# EAGLE design iomodul (EAGLE 6.2)

## Sheet 1 of 4
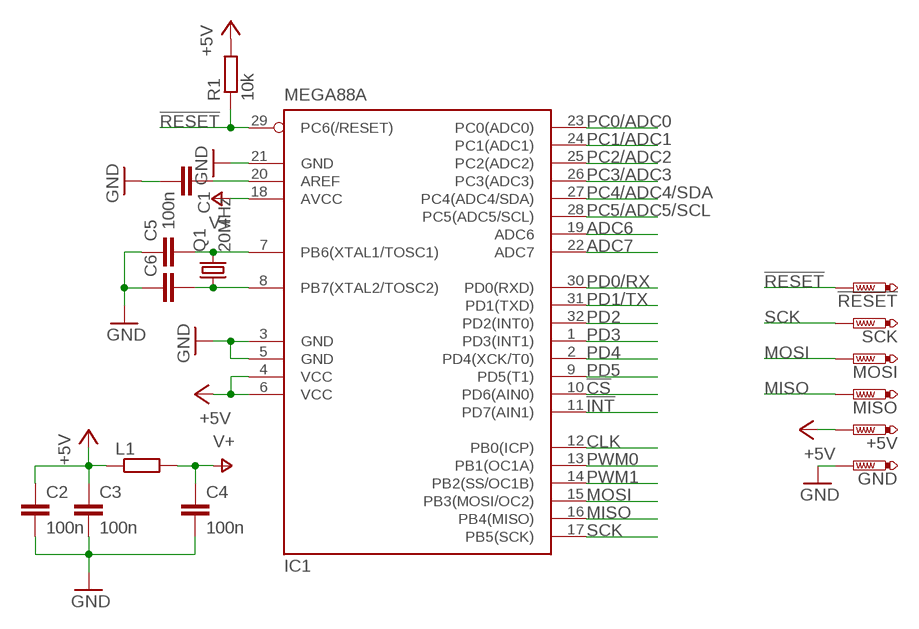
[diagram p0: schematic, sheet 1]

### Parts
!RESET  PTR1TP12R  [TP12R]
+5V  PTR1TP12R  [TP12R]
C1  100n  C-EUC0805  [C0805]
C2  100n  C-EUC0805  [C0805]
C3  100n  C-EUC0805  [C0805]
C4  100n  C-EUC0805  [C0805]
C5  C-EUC0805  [C0805]
C6  C-EUC0805  [C0805]
GND  PTR1TP12R  [TP12R]
IC1  MEGA88A  MEGA8-AI  [TQFP32-08]
L1  R-EU_R0805  [R0805]
MISO  PTR1TP12R  [TP12R]
MOSI  PTR1TP12R  [TP12R]
Q1  20MHz  CRYSTALHC49S  [HC49/S]
R1  10k  R-EU_R0805  [R0805]
SCK  PTR1TP12R  [TP12R]

### Nets
!CS: IC1.10(PD6(AIN0)) ; also sheet 2
!INT: IC1.11(PD7(AIN1)) ; also sheet 2
!RESET: !RESET.TP IC1.29(PC6(/RESET)) R1.1 ; also sheet 2
+5V: +5V.TP C2.1 C3.1 IC1.4(VCC) IC1.6(VCC) L1.1 R1.2 ; also sheet 2,3,4
ADC6: IC1.19(ADC6) ; also sheet 4
ADC7: IC1.22(ADC7) ; also sheet 4
AREF: C1.1 IC1.20(AREF)
CLK: IC1.12(PB0(ICP)) ; also sheet 2
GND: C1.2 C2.2 C3.2 C4.2 C5.1 C6.1 GND.TP IC1.3(GND) IC1.5(GND) IC1.21(GND) ; also sheet 2,3,4
MISO: IC1.16(PB4(MISO)) MISO.TP ; also sheet 2
MOSI: IC1.15(PB3(MOSI/OC2)) MOSI.TP ; also sheet 2
PC0/ADC0: IC1.23(PC0(ADC0)) ; also sheet 3
PC1/ADC1: IC1.24(PC1(ADC1)) ; also sheet 3
PC2/ADC2: IC1.25(PC2(ADC2)) ; also sheet 3
PC3/ADC3: IC1.26(PC3(ADC3)) ; also sheet 3
PC4/ADC4/SDA: IC1.27(PC4(ADC4/SDA)) ; also sheet 3
PC5/ADC5/SCL: IC1.28(PC5(ADC5/SCL)) ; also sheet 3
PD0/RX: IC1.30(PD0(RXD)) ; also sheet 3
PD1/TX: IC1.31(PD1(TXD)) ; also sheet 3
PD2: IC1.32(PD2(INT0)) ; also sheet 3
PD3: IC1.1(PD3(INT1)) ; also sheet 3
PD4: IC1.2(PD4(XCK/T0)) ; also sheet 3
PD5: IC1.9(PD5(T1)) ; also sheet 3
PWM0: IC1.13(PB1(OC1A)) ; also sheet 3
PWM1: IC1.14(PB2(SS/OC1B)) ; also sheet 3
SCK: IC1.17(PB5(SCK)) SCK.TP ; also sheet 2
V+: C4.1 IC1.18(AVCC) L1.2
XTAL1: C5.2 IC1.7(PB6(XTAL1/TOSC1)) Q1.2
XTAL2: C6.2 IC1.8(PB7(XTAL2/TOSC2)) Q1.1

## Sheet 2 of 4
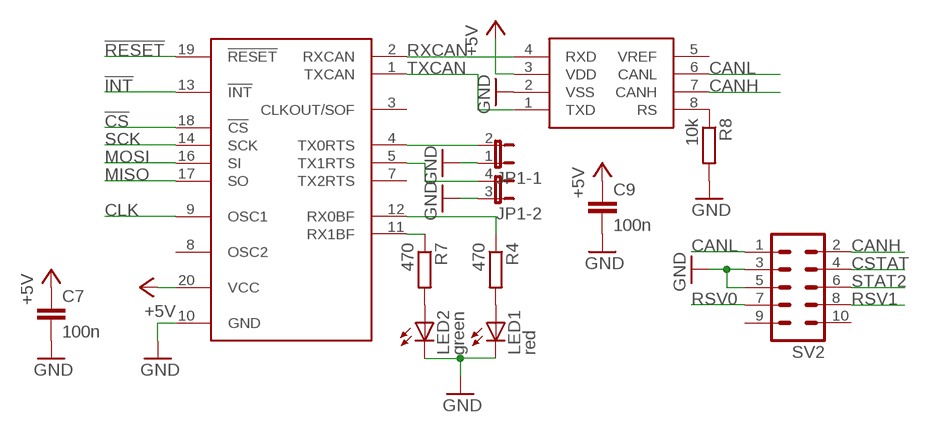
[diagram p1: schematic, sheet 2]

### Parts
C7  100n  C-EUC0805  [C0805]
C9  100n  C-EUC0805  [C0805]
JP1  JP2QE  [JP2Q]
LED1  red  LEDCHIP-LED0805  [CHIP-LED0805]
LED2  green  LEDCHIP-LED0805  [CHIP-LED0805]
R4  470  R-EU_R0805  [R0805]
R7  470  R-EU_R0805  [R0805]
R8  10k  R-EU_R0805  [R0805]
SV2  MA05-2  [MA05-2]
U$1  MCP2515  [TSSOP20]
U$2  MCP2551  [SO-08]

### Nets
!CS: U$1.18(!CS) ; also sheet 1
!INT: U$1.13(!INT) ; also sheet 1
!RESET: U$1.19(!RESET) ; also sheet 1
+5V: C7.1 C9.1 U$1.20(VCC) U$2.3(VDD) ; also sheet 1,3,4
CANH: SV2.2 U$2.7(CANH)
CANL: SV2.1 U$2.6(CANL)
CLK: U$1.9(OSC1) ; also sheet 1
CSTAT: SV2.4
GND: C7.2 C9.2 JP1.1 JP1.3 LED1.C LED2.C R8.2 SV2.3 SV2.5 U$1.10(GND) U$2.2(VSS) ; also sheet 1,3,4
LED0: LED1.A R4.2
LED1: LED2.A R7.2
LED_OUT0: R4.1 U$1.12(RX0BF)
LED_OUT1: R7.1 U$1.11(RX1BF)
MISO: U$1.17(SO) ; also sheet 1
MOSI: U$1.16(SI) ; also sheet 1
N$1: JP1.2 U$1.4(TX0RTS)
N$2: JP1.4 U$1.5(TX1RTS)
RS: R8.1 U$2.8(RS)
RSV0: SV2.7
RSV1: SV2.8
RXCAN: U$1.2(RXCAN) U$2.4(RXD)
SCK: U$1.14(SCK) ; also sheet 1
STAT2: SV2.6
TXCAN: U$1.1(TXCAN) U$2.1(TXD)
Unconnected: SV2.9 SV2.10 U$1.3(CLKOUT/SOF) U$1.7(TX2RTS) U$1.8(OSC2) U$2.5(VREF)

## Sheet 3 of 4
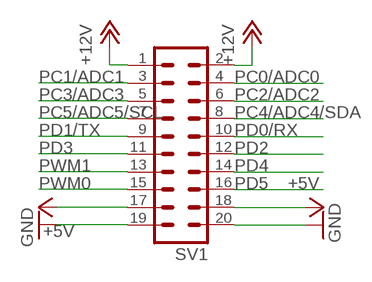
[diagram p2: schematic, sheet 3]

### Parts
SV1  MA10-2  [MA10-2]

### Nets
+5V: SV1.17 SV1.18 ; also sheet 1,2,4
+12V: SV1.1 SV1.2 ; also sheet 4
GND: SV1.19 SV1.20 ; also sheet 1,2,4
PC0/ADC0: SV1.4 ; also sheet 1
PC1/ADC1: SV1.3 ; also sheet 1
PC2/ADC2: SV1.6 ; also sheet 1
PC3/ADC3: SV1.5 ; also sheet 1
PC4/ADC4/SDA: SV1.8 ; also sheet 1
PC5/ADC5/SCL: SV1.7 ; also sheet 1
PD0/RX: SV1.10 ; also sheet 1
PD1/TX: SV1.9 ; also sheet 1
PD2: SV1.12 ; also sheet 1
PD3: SV1.11 ; also sheet 1
PD4: SV1.14 ; also sheet 1
PD5: SV1.16 ; also sheet 1
PWM0: SV1.15 ; also sheet 1
PWM1: SV1.13 ; also sheet 1

## Sheet 4 of 4
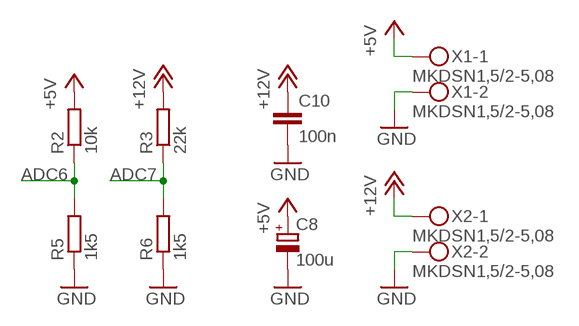
[diagram p3: schematic, sheet 4]

### Parts
C8  100u  CPOL-EUE2.5-6  [E2,5-6]
C10  100n  C-EUC0805  [C0805]
R2  10k  R-EU_R0805  [R0805]
R3  22k  R-EU_R0805  [R0805]
R5  1k5  R-EU_R0805  [R0805]
R6  1k5  R-EU_R0805  [R0805]
X1  MKDSN1,5/2-5,08  [MKDSN1,5/2-5,08]
X2  MKDSN1,5/2-5,08  [MKDSN1,5/2-5,08]

### Nets
+5V: C8.+ R2.2 X1.1 ; also sheet 1,2,3
+12V: C10.1 R3.2 X2.1 ; also sheet 3
ADC6: R2.1 R5.2 ; also sheet 1
ADC7: R3.1 R6.2 ; also sheet 1
GND: C8.- C10.2 R5.1 R6.1 X1.2 X2.2 ; also sheet 1,2,3

## Library data of the parts
!RESET +5V GND MISO MOSI SCK = testpad:PTR1: TEST PIN
C1-C7 C9 C10 = rcl:C-EU: CAPACITOR, European symbol
C8 = rcl:CPOL-EU: POLARIZED CAPACITOR, European symbol
IC1 = atmel:MEGA8: MICROCONTROLLER 8 Kbytes FLASH, 1 kbytes SRAM, 512 bytes EEPROM, USART, 6-channel 10 bit ADC, 2-channel 8 bit ADC Pin compatible with Atmega48, ATMega88, ATMega168 Source: avr.lbr; MPN: ATMEGA8-16AU; OC_FARNELL: 9171371; OC_NEWARK: 73M8863
JP1 = jumper:JP2QE: JUMPER
L1 R1-R8 = rcl:R-EU_: RESISTOR, European symbol
LED1 LED2 = led:LED: LED OSRAM: - CHIPLED LG R971, LG N971, LY N971, LG Q971, LY Q971, LO R971, LY R971 LH N974, LH R974 LS Q976, LO Q976, LY Q976 LO Q996 - Hyper CHIPLED LW Q18S LB Q993, LB Q99A, LB R99A - SideLED LS A670, LO A670, LY A670, LG A670, LP A670 LB A673, LV A673, LT A673, LW A673 LH A674 LY A675 LS A676, LA A676, LO A676, LY A676, LW A676 LS A679, LY A679, LG A679 - Hyper Micro SIDELED® LS Y876, LA Y876, LO Y876, LY Y876 LT Y87S - SmartLED LW L88C, LW L88S LB L89C, LB L89S, LG L890 LS L89K, LO L89K, LY L89K LS L896, LA L896, LO L896, LY L896 - TOPLED LS T670, LO T670, LY T670, LG T670, LP T670 LSG T670, LSP T670, LSY T670, LOP T670, LYG T670 LG T671, LOG T671, LSG T671 LB T673, LV T673, LT T673, LW T673 LH T674 LS T676, LA T676, LO T676, LY T676, LB T676, LH T676, LSB T676, LW T676 LB T67C, LV T67C, LT T67C, LS T67K, LO T67K, LY T67K, LW E67C LS E67B, LA E67B, LO E67B, LY E67B, LB E67C, LV E67C, LT E67C LW T67C LS T679, LY T679, LG T679 LS T770, LO T770, LY T770, LG T770, LP T770 LB T773, LV T773, LT T773, LW T773 LH T774 LS E675, LA E675, LY E675, LS T675 LS T776, LA T776, LO T776, LY T776, LB T776 LHGB T686 LT T68C, LB T68C - Hyper Mini TOPLED® LB M676 - Mini TOPLED Santana® LG M470 LS M47K, LO M47K, LY M47K Source: http://www.osram.convergy.de LUXEON: - LUMILED® LXK2-PW12-R00, LXK2-PW12-S00, LXK2-PW14-U00, LXK2-PW14-V00 LXK2-PM12-R00, LXK2-PM12-S00, LXK2-PM14-U00 LXK2-PE12-Q00, LXK2-PE12-R00, LXK2-PE12-S00, LXK2-PE14-T00, LXK2-PE14-U00 LXK2-PB12-K00, LXK2-PB12-L00, LXK2-PB12-M00, LXK2-PB14-N00, LXK2-PB14-P00, LXK2-PB14-Q00 LXK2-PR12-L00, LXK2-PR12-M00, LXK2-PR14-Q00, LXK2-PR14-R00 LXK2-PD12-Q00, LXK2-PD12-R00, LXK2-PD12-S00 LXK2-PH12-R00, LXK2-PH12-S00 LXK2-PL12-P00, LXK2-PL12-Q00, LXK2-PL12-R00 Source: www.luxeon.com KINGBRIGHT: KA-3528ASYC Source: www.kingbright.com
Q1 = crystal:CRYSTAL: CRYSTAL; OC_FARNELL: 1667008; OC_NEWARK: unknown
SV1 = con-lstb:MA10-2: PIN HEADER; OC_FARNELL: unknown; OC_NEWARK: unknown
SV2 = con-lstb:MA05-2: PIN HEADER; OC_FARNELL: unknown; OC_NEWARK: unknown
U$1 = mcp2515:MCP2515
U$2 = mcp2551:MCP2551
X1 X2 = con-phoenix-508:MKDSN1,5/2-5,08: MKDSN 1,5/ 2-5,08 Printklemme Nennstrom: 13,5 A Nennspannung: 250 V Rastermaß: 5,08 mm Polzahl: 2 Anschlussart: Schraubanschluss Montage: Löten Anschlussrichtung Leiter/Platine: 0 ° Artikelnummer: 1729128 Source: http://eshop.phoenixcontact.com .. 1729128.pdf; MPN: MKDSN 1,5/2-5.08; OC_FARNELL: 1792903; OC_NEWARK: 30M2397

## Board
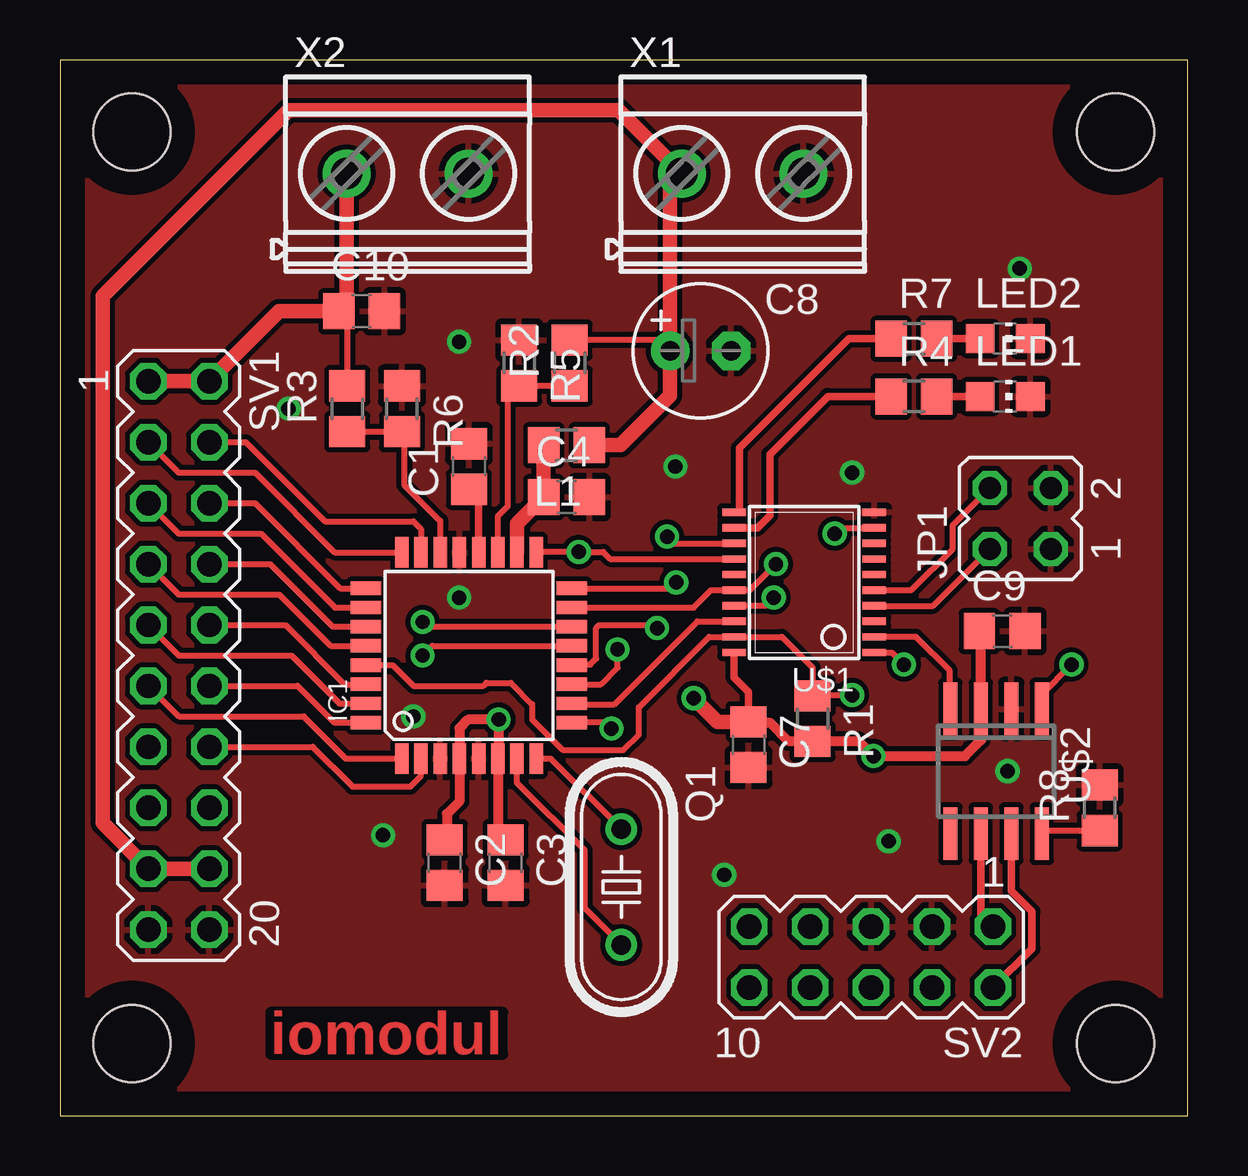
[diagram p4: board, top side]
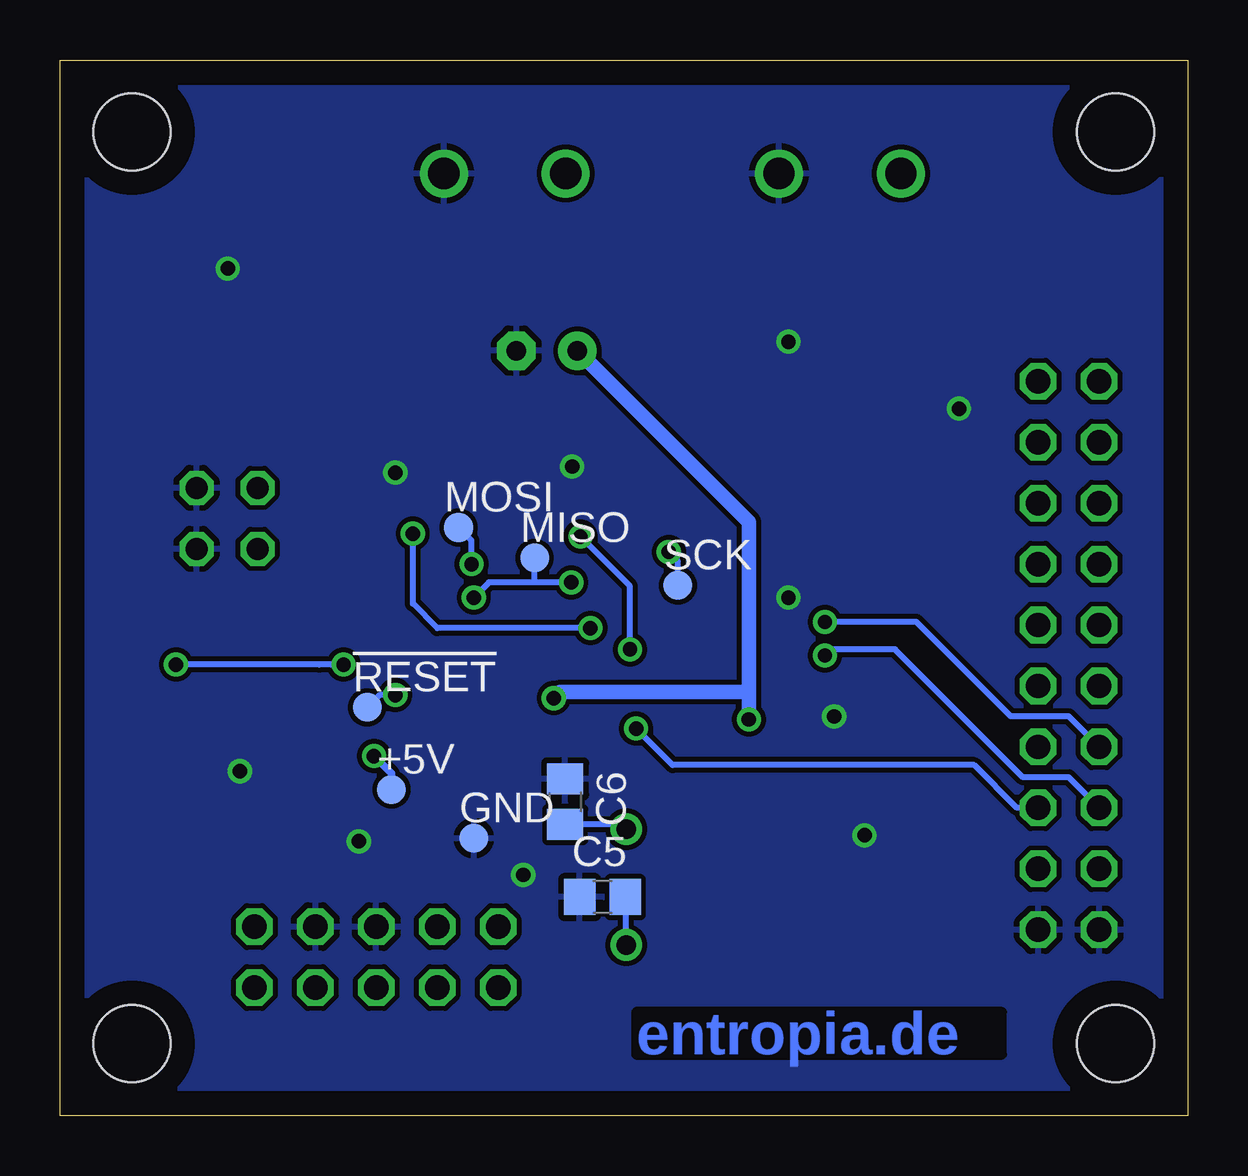
[diagram p5: board, bottom side, seen from below]

Size 47 x 44 mm. Coordinates in mm from the lower left corner, seen from the top.
Outline: 0,0 47,0 47,44 0,44 0,0
Copper layers (1*16): Top 0.035mm / dielectric 1.5mm / Bottom 0.035mm
Design rules: minimum track width 10mil, minimum drill 20mil, track to track 8mil, track to pad 8mil, pad to pad 8mil, via to via 8mil, smd to smd 8mil, copper to edge 40mil, drill to drill 8mil, minimum pad ring 10mil, minimum via ring 8mil, stop-mask expansion 4mil, vias tented up to drill 0mil, thermal gap 10mil
Holes 3.2 mm at 3,3 3,41 44,41 44,3

### Footprints (pad centres in the part's own frame; a part is rotated, then mirrored left to right if it is on the bottom)
TP12R = smd 1.2 x 1.2: TP 0,0
C0805 = smd 1.3 x 1.5: 1 -0.95,0; 2 0.95,0
E2,5-6 = drill 0.813 pad 1.6: + -1.27,0 | drill 0.813 pad 1.6 octagon: - 1.27,0
TQFP32-08 = smd 1.27 x 0.559: 1 -4.293,2.8; 2 -4.293,2; 3 -4.293,1.2; 4 -4.293,0.4; 5 -4.293,-0.4; 6 -4.293,-1.2; 7 -4.293,-2; 8 -4.293,-2.8; 17 4.293,-2.8; 18 4.293,-2; 19 4.293,-1.2; 20 4.293,-0.4; 21 4.293,0.4; 22 4.293,1.2; 23 4.293,2; 24 4.293,2.8 | smd 0.559 x 1.27: 9 -2.8,-4.293; 10 -2,-4.293; 11 -1.2,-4.293; 12 -0.4,-4.293; 13 0.4,-4.293; 14 1.2,-4.293; 15 2,-4.293; 16 2.8,-4.293; 25 2.8,4.293; 26 2,4.293; 27 1.2,4.293; 28 0.4,4.293; 29 -0.4,4.293; 30 -1.2,4.293; 31 -2,4.293; 32 -2.8,4.293
JP2Q = drill 0.914 octagon: 1 -1.27,-1.27; 2 -1.27,1.27; 3 1.27,-1.27; 4 1.27,1.27
R0805 = smd 1.3 x 1.5: 1 -0.95,0; 2 0.95,0
CHIP-LED0805 = smd 1.2 x 1.2: A 0,-1.05; C 0,1.05
HC49/S = drill 0.813: 1 -2.413,0; 2 2.413,0
MA10-2 = drill 1.016 octagon: 1 -11.43,-1.27; 2 -11.43,1.27; 3 -8.89,-1.27; 4 -8.89,1.27; 5 -6.35,-1.27; 6 -6.35,1.27; 7 -3.81,-1.27; 8 -3.81,1.27; 9 -1.27,-1.27; 10 -1.27,1.27; 11 1.27,-1.27; 12 1.27,1.27; 13 3.81,-1.27; 14 3.81,1.27; 15 6.35,-1.27; 16 6.35,1.27; 17 8.89,-1.27; 18 8.89,1.27; 19 11.43,-1.27; 20 11.43,1.27
MA05-2 = drill 1.016 octagon: 1 -5.08,-1.27; 2 -5.08,1.27; 3 -2.54,-1.27; 4 -2.54,1.27; 5 0,-1.27; 6 0,1.27; 7 2.54,-1.27; 8 2.54,1.27; 9 5.08,-1.27; 10 5.08,1.27
TSSOP20 = smd 0.305 x 0.991: 1 -2.925,-2.918; 2 -2.275,-2.918; 3 -1.625,-2.918; 4 -0.975,-2.918; 5 -0.325,-2.918; 6 0.325,-2.918; 7 0.975,-2.918; 8 1.625,-2.918; 9 2.275,-2.918; 10 2.925,-2.918; 11 2.925,2.918; 12 2.275,2.918; 13 1.625,2.918; 14 0.975,2.918; 15 0.325,2.918; 16 -0.325,2.918; 17 -0.975,2.918; 18 -1.625,2.918; 19 -2.275,2.918; 20 -2.925,2.918
SO-08 = smd 0.6 x 2.2: 1 -1.905,-2.6; 2 -0.635,-2.6; 3 0.635,-2.6; 4 1.905,-2.6; 5 1.905,2.6; 6 0.635,2.6; 7 -0.635,2.6; 8 -1.905,2.6
MKDSN1,5/2-5,08 = drill 1.3 pad 2: 1 -2.561,0.025; 2 2.519,0.025

### Placement (x,y rotation side)
!RESET  34.2,17.02 0 bottom
+5V  33.18,13.59 0 bottom
C1  17.05,27.05 90 top
C2  16.03,10.54 270 top
C3  18.57,10.54 270 top
C4  21.11,25.78 0 top
C5  24.38,9.11 0 bottom
C6  25.94,13.08 270 bottom
C7  28.7,15.46 270 top
C8  26.7,31.88 0 top
C9  39.27,20.19 0 top
C10  12.57,33.53 0 top
GND  29.75,11.56 0 bottom
IC1  17.05,19.18 90 top
JP1  40.04,24.89 90 top
L1  21.11,27.94 180 top
LED1  39.4,29.97 270 top
LED2  39.4,32.38 270 top
MISO  27.21,23.24 0 bottom
MOSI  30.39,24.51 0 bottom
Q1  23.4,9.53 270 top
R1  31.37,16.54 270 top
R2  21.24,31.37 90 top
R3  11.97,29.46 90 top
R4  35.59,29.97 0 top
R5  19.14,31.37 270 top
R6  14.26,29.46 270 top
R7  35.59,32.38 0 top
R8  43.34,12.83 90 top
SCK  21.24,22.1 0 bottom
SV1  4.95,19.18 270 top
SV2  33.81,6.6 180 top
U$1  31.02,22.23 90 top
U$2  39.02,14.35 180 top
X1  28.48,39.24 0 top
X2  14.51,39.24 0 top

### Tracks (layer width: path | path; a pad name or v marks a point on that pad's centre or on a via)
!CS
  Top 0.254: U$1.18 26.57,20.6 23.11,17.14 21.38,17.14 IC1.10
!INT  (via drill 0.6)
  Top 0.254: U$1.13 25.59,23.85 v25.3,24.13 | IC1.11 22.55,17.98 23.24,18.67 v23.24,19.43
  Bottom 0.254: v23.24,19.43 23.24,22.07 v25.3,24.13
!RESET  (via drill 0.6)
  Top 0.254: IC1.29 13.86,18.78 14.73,17.91 17.65,17.91 17.78,18.03 18.8,18.03 19.68,17.14 19.68,16.51 20.95,15.24 23.5,15.24 24.13,15.88 24.13,17.02 27.06,19.95 U$1.19 30.09,19.95 31.37,18.67 R1.1 31.4,17.53 v33.02,17.53
  Bottom 0.254: v33.02,17.53 33.69,17.53 !RESET.TP
+5V  (via drill 0.6)
  Top 0.254: C8.+ 24.99,32.32 R2.2
  Top 0.305: U$1.20 28.1,18.25 28.7,17.65 C7.1
  Top 0.406: C3.1 18.25,11.81 IC1.6 18.29,14.92 v18.29,16.51 17.02,16.51 16.65,16.14 IC1.4 16.65,13.09 16.13,12.57 16.13,11.59 C2.1 | C9.1 38.39,20.13 U$2.3 38.39,15.65 37.72,14.99 v33.91,14.99 33.27,15.62 31.4,15.62 | 31.4,15.62 R1.2 | 31.4,15.62 30.35,15.62 29.59,16.38 28.73,16.38 C7.1
  Top 0.61: L1.1 23.37,27.94 25.43,30 C8.+ 25.43,38.78 X1.1 23.28,41.91 9.53,41.91 1.78,34.16 1.78,12.19 SV1.17 SV1.18 | v26.42,17.4 27.4,16.41 C7.1
  Bottom 0.305: v33.91,14.99 33.18,14.26 +5V.TP
  Bottom 0.61: 18.29,17.65 v18.29,16.51 | 18.29,17.65 18.29,24.73 C8.+ | v26.42,17.4 26.16,17.65 18.29,17.65
+12V
  Top 0.254: R3.2 11.97,33.18 C10.1
  Top 0.61: SV1.1 SV1.2 9.14,33.53 C10.1 11.95,33.85 X2.1
ADC6
  Top 0.254: R2.1 R5.2 18.67,29.94 18.67,25.4 18.25,24.98 IC1.19
ADC7
  Top 0.254: IC1.22 15.85,24.79 14.35,26.29 14.35,28.42 R6.2 R3.1
AREF
  Top 0.305: IC1.20 17.45,25.7 C1.1
CANH
  Top 0.305: U$2.7 39.66,9.37 40.51,8.51 40.51,6.95 SV2.2
CANL
  Top 0.305: U$2.6 38.39,8.38 SV2.1
CLK  (via drill 0.6)
  Top 0.254: U$1.9 32.53,24.5 v32.29,24.26 | IC1.12 21.36,18.8 22.1,18.8 22.35,19.05 22.35,20.32 22.48,20.45 24.77,20.45 v24.89,20.32
  Bottom 0.254: v32.29,24.26 32.29,21.34 31.27,20.32 v24.89,20.32
GND  (via drill 0.6)
  other vias: 16.64,21.59 14.73,16.64 9.53,29.46 16.64,32.26 13.46,11.68 27.69,10.03 33.02,26.8 39.5,14.35 40.01,35.31 25.65,27.05 34.54,11.43
  pour Bottom: -1.27,45.6 48.29,45.6 48.29,-1.27 -1.27,-1.27
  pour Top: -1.27,45.6 48.29,45.6 48.29,-1.27 -1.27,-1.27
LED0
  Top 0.305: R4.2 LED1.A
LED1
  Top 0.305: R7.2 LED2.A
LED_OUT0
  Top 0.305: U$1.12 29.07,24.5 29.59,25.02 29.59,27.56 32,29.97 R4.1
LED_OUT1
  Top 0.305: R7.1 32.89,32.38 28.32,27.81 28.32,25.15 U$1.11
MISO  (via drill 0.6)
  Top 0.254: IC1.16 25.44,21.98 v25.69,22.23 | U$1.17 29.41,21.25 v29.75,21.59
  Bottom 0.254: v25.69,22.23 27.18,22.23 | 27.18,22.23 29.11,22.23 v29.75,21.59 | MISO.TP 27.21,22.26 27.18,22.23
MOSI  (via drill 0.6)
  Top 0.254: IC1.15 26.42,21.18 27.14,21.9 U$1.16 28.76,21.9 v29.84,22.99
  Bottom 0.254: v29.84,22.99 29.84,23.97 MOSI.TP
N$1
  Top 0.254: U$1.4 36.4,21.25 JP1.2
N$2
  Top 0.254: U$1.5 35.49,21.9 37.21,23.62 37.21,24.61 JP1.4
PC0/ADC0
  Top 0.254: IC1.23 15.05,24.45 14.73,24.77 11.05,24.77 7.75,28.07 SV1.4
PC1/ADC1
  Top 0.254: IC1.24 11.46,23.47 8.13,26.8 4.95,26.8 SV1.3
PC2/ADC2
  Top 0.254: IC1.25 11.68,21.98 8.13,25.53 SV1.6
PC3/ADC3
  Top 0.254: IC1.26 11.46,21.18 8.38,24.26 4.95,24.26 SV1.5
PC4/ADC4/SDA
  Top 0.254: IC1.27 11.37,20.38 8.76,22.99 SV1.8
PC5/ADC5/SCL
  Top 0.254: IC1.28 11.28,19.58 9.14,21.72 4.95,21.72 SV1.7
PD0/RX
  Top 0.254: SV1.10 9.4,20.45 11.87,17.98 IC1.30
PD1/TX
  Top 0.254: IC1.31 11.65,17.18 9.65,19.18 4.95,19.18 SV1.9
PD2
  Top 0.254: IC1.32 11.44,16.38 9.91,17.91 SV1.12
PD3
  Top 0.254: SV1.11 4.95,16.64 10.16,16.64 11.91,14.88 IC1.1
PD4
  Top 0.254: IC1.2 15.05,14.16 14.61,13.72 12.19,13.72 10.54,15.37 SV1.14
PD5  (via drill 0.6)
  Top 0.254: IC1.9 22.74,16.38 v22.99,16.13
  Bottom 0.254: SV1.16 7.11,12.83 8.89,14.61 21.46,14.61 v22.99,16.13
PWM0  (via drill 0.6)
  Top 0.254: IC1.13 15.51,19.58 v15.11,19.18
  Bottom 0.254: v15.11,19.18 14.86,19.43 12.19,19.43 6.86,14.1 4.95,14.1 SV1.15
PWM1  (via drill 0.6)
  Top 0.254: v15.11,20.57 15.31,20.38 IC1.14
  Bottom 0.254: SV1.13 4.95,16.64 7.37,16.64 11.3,20.57 v15.11,20.57
RS
  Top 0.254: R8.1 41.05,11.88 U$2.8
RXCAN
  Top 0.254: U$1.2 35.68,19.95 37.08,18.54 37.08,16.98 U$2.4
SCK  (via drill 0.6)
  Top 0.254: U$1.14 22.93,23.2 22.64,23.5 v21.62,23.5 19.88,23.5 IC1.17
  Bottom 0.254: SCK.TP 21.24,23.11 v21.62,23.5
TXCAN  (via drill 0.6)
  Top 0.254: U$2.1 40.93,17.56 v42.16,18.8 | U$1.1 34.67,19.3 v35.18,18.8
  Bottom 0.254: v42.16,18.8 36.2,18.8 35.69,18.8 v35.18,18.8
V+
  Top 0.61: IC1.18 19.05,24.67 C4.1 L1.2
XTAL1
  Top 0.254: IC1.7 19.05,13.88 21.88,11.05 21.88,8.64 Q1.2
  Bottom 0.254: Q1.2 23.4,9.08 C5.2
XTAL2
  Top 0.254: IC1.8 20.45,14.88 Q1.1
  Bottom 0.254: C6.2 23.59,12.13 Q1.1

### Text on the board
Top: iomodul
Bottom: entropia.de